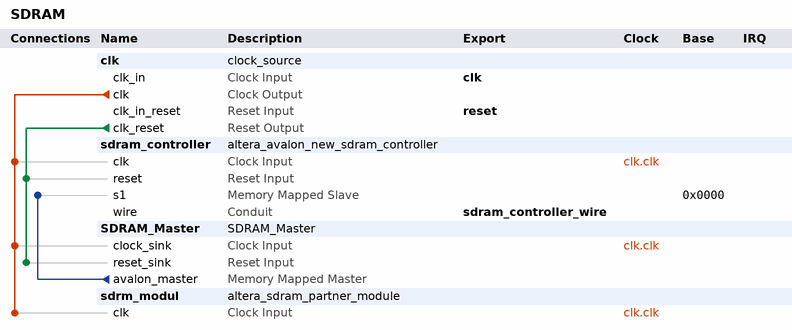
[diagram p0: system contents]
# Platform Designer (Qsys) system SDRAM, Cyclone II EP2C70F896C6
# Parameters at their usual value, and those the tool derives, are not listed.
package require -exact qsys 13.0
create_system SDRAM
set_project_property DEVICE_FAMILY {Cyclone II}
set_project_property DEVICE EP2C70F896C6

add_instance clk clock_source 13.0
set_instance_parameter_value clk clockFrequency 50000000

add_instance sdram_controller altera_avalon_new_sdram_controller 13.0.1.99.2
set_instance_parameter_value sdram_controller TAC 5.5
set_instance_parameter_value sdram_controller TRCD 20.0
set_instance_parameter_value sdram_controller TRP 20.0
set_instance_parameter_value sdram_controller casLatency 3
set_instance_parameter_value sdram_controller columnWidth 8
set_instance_parameter_value sdram_controller dataWidth 32
set_instance_parameter_value sdram_controller generateSimulationModel true
set_instance_parameter_value sdram_controller model single_Micron_MT48LC4M32B2_7_chip
set_instance_parameter_value sdram_controller numberOfBanks 2
set_instance_parameter_value sdram_controller numberOfChipSelects 1
set_instance_parameter_value sdram_controller powerUpDelay 100.0
set_instance_parameter_value sdram_controller refreshPeriod 15.625
set_instance_parameter_value sdram_controller rowWidth 11

add_instance SDRAM_Master SDRAM_Master 1.0

add_instance sdrm_modul altera_sdram_partner_module 11.0
set_instance_parameter_value sdrm_modul SDRAM_DATA_WIDTH 32
set_instance_parameter_value sdrm_modul SDRAM_BANK_WIDTH 1
set_instance_parameter_value sdrm_modul CAS_LATENCY 1
set_instance_parameter_value sdrm_modul SDRAM_COL_WIDTH 11
set_instance_parameter_value sdrm_modul SDRAM_ROW_WIDTH 8

# connections
add_connection clk.clk sdram_controller.clk clock
add_connection clk.clk SDRAM_Master.clock_sink clock
add_connection clk.clk sdrm_modul.clk clock
add_connection clk.clk_reset sdram_controller.reset reset
add_connection clk.clk_reset SDRAM_Master.reset_sink reset
add_connection SDRAM_Master.avalon_master sdram_controller.s1 avalon
set_connection_parameter_value SDRAM_Master.avalon_master/sdram_controller.s1 baseAddress 0x0000

# exported interfaces
add_interface clk clock sink
set_interface_property clk EXPORT_OF clk.clk_in
add_interface reset reset sink
set_interface_property reset EXPORT_OF clk.clk_in_reset
add_interface sdram_controller_wire conduit end
set_interface_property sdram_controller_wire EXPORT_OF sdram_controller.wire

set_interconnect_requirement {$system} qsys_mm.clockCrossingAdapter HANDSHAKE
set_interconnect_requirement {$system} qsys_mm.maxAdditionalLatency 1

save_system SDRAM.qsys
